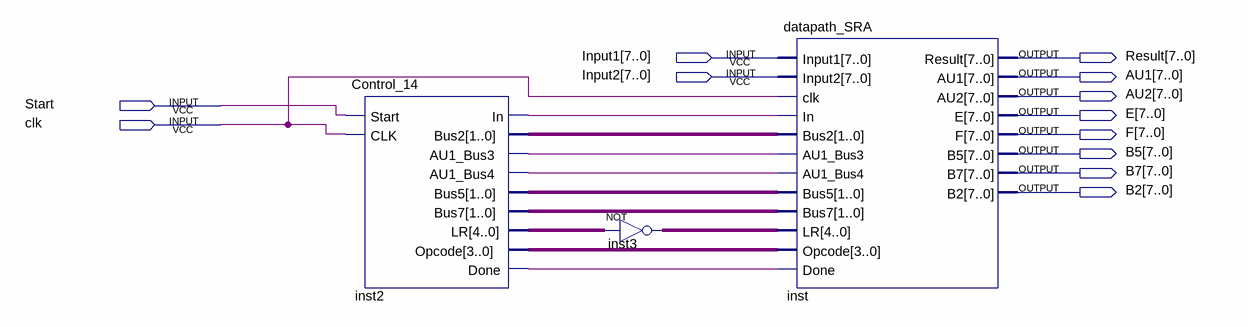
[diagram p0: schematic sheet]
// Quartus schematic ver7.bdf as structural Verilog: 3 symbols, 12 pins
module ver7 (
  input  [7:0] Input1,
  input  [7:0] Input2,
  input  Start,
  input  clk,
  output [7:0] Result,
  output [7:0] AU1,
  output [7:0] AU2,
  output [7:0] E,
  output [7:0] F,
  output [7:0] B5,
  output [7:0] B7,
  output [7:0] B2
);

  wire inst2_au1_bus3, inst2_au1_bus4, inst2_done, inst2_in;
  wire [1:0] inst2_bus2, inst2_bus5, inst2_bus7;
  wire [3:0] inst2_opcode;
  wire [4:0] inst2_lr, inst3_out;

  Control_14 inst2 (
    .Start(Start), .CLK(clk), .In(inst2_in), .Bus2(inst2_bus2), .AU1_Bus3(inst2_au1_bus3),
    .AU1_Bus4(inst2_au1_bus4), .Bus5(inst2_bus5), .Bus7(inst2_bus7), .LR(inst2_lr), .Opcode(inst2_opcode),
    .Done(inst2_done));
  assign inst3_out = ~inst2_lr;  // NOT inst3, 5 bits wide
  datapath_SRA inst (
    .Input1(Input1), .Input2(Input2), .clk(clk), .In(inst2_in), .Bus2(inst2_bus2), .AU1_Bus3(inst2_au1_bus3),
    .AU1_Bus4(inst2_au1_bus4), .Bus5(inst2_bus5), .Bus7(inst2_bus7), .LR(inst3_out), .Opcode(inst2_opcode),
    .Done(inst2_done), .Result(Result), .AU1(AU1), .AU2(AU2), .E(E), .F(F), .B5(B5), .B7(B7), .B2(B2));
endmodule
